# Altium schematic sheet RHD2132_headstage1.SchDoc: RHD2132_headstage1
size 270 x 207 mm; Date: 15/06/2023 10:15:25 PM; SheetNumber: 1; GateName_1: G$1; SymbolName_1: LETTER_L; LibraryName: frames; DeviceSetName: LETTER_L; GateName_2: G$2; SymbolName_2: DOCFIELD
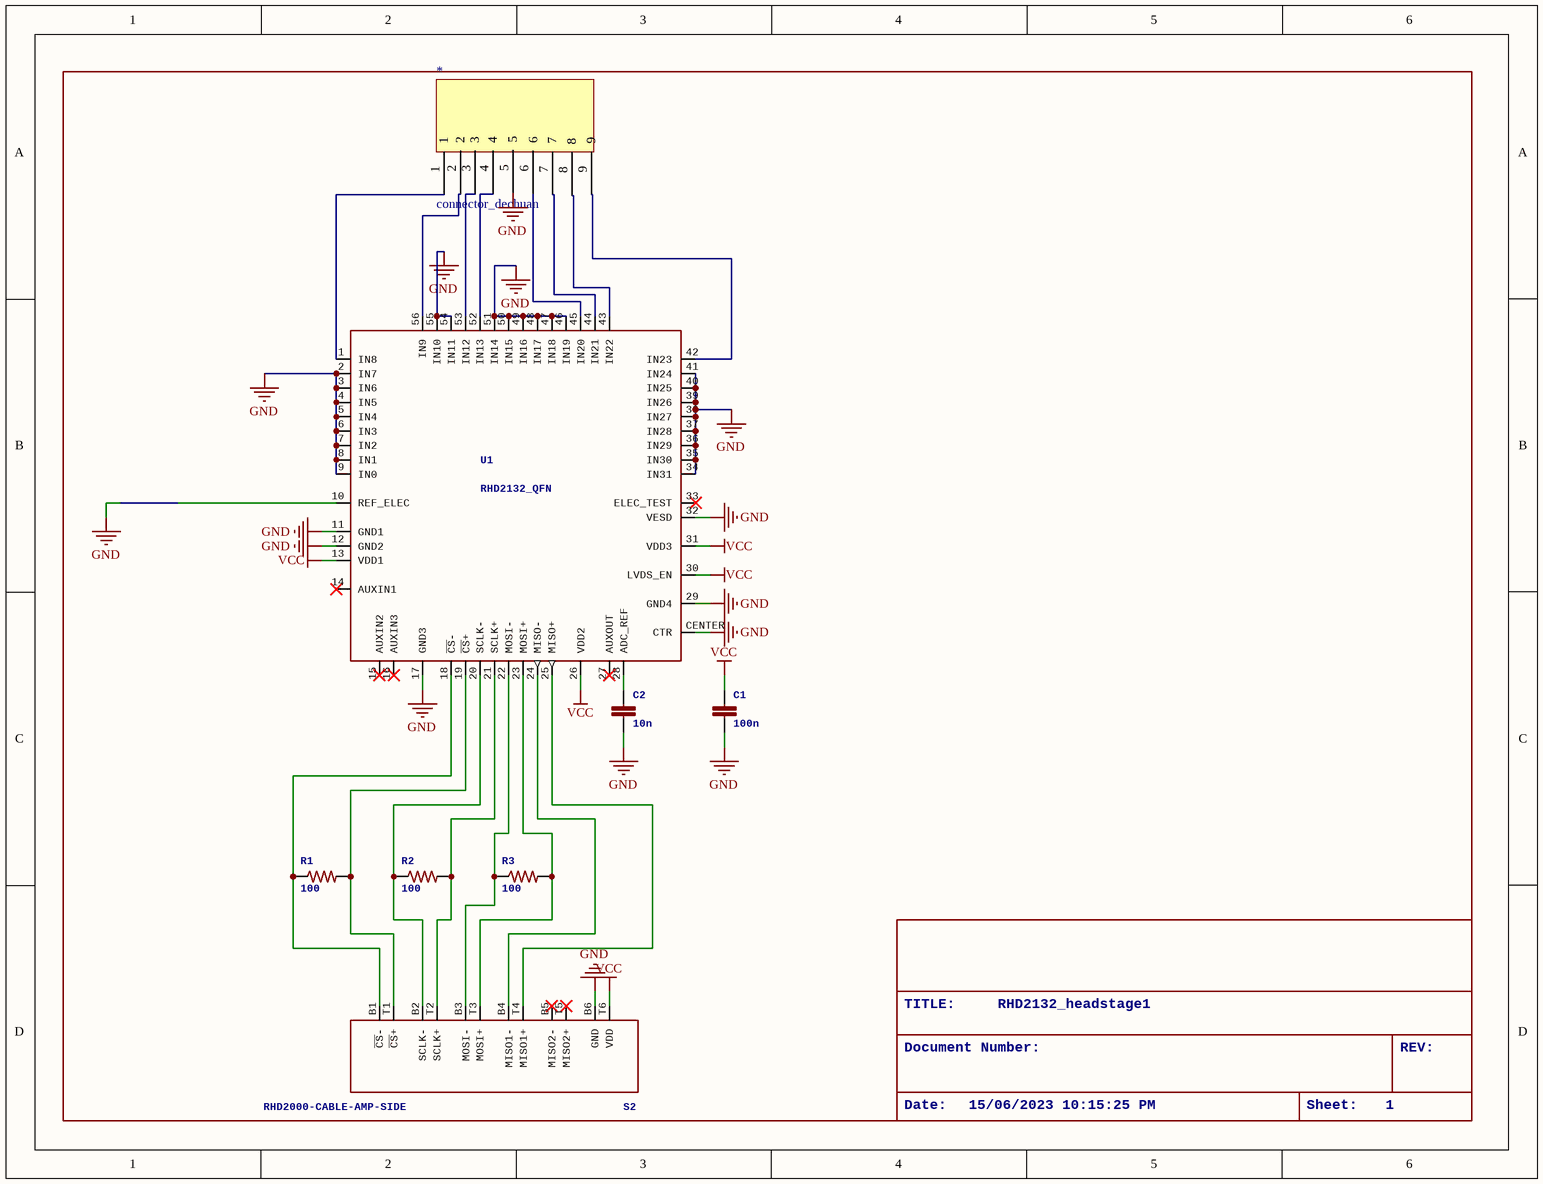
[diagram p0: RHD2132_headstage1.SchDoc]

## Parts
*  connector_dechuan  [connector_dechuan]
C1  100n  [0402]
C2  10n  [0402]
R1  100  [0402]
R2  100  [0402]
R3  100  [0402]
S2  RHD2000-CABLE-AMP-SIDE  [OMNETICS_PZN-12-AA]
U1  RHD2132_QFN  [QFN56_8_X_8_LARGE]

## Nets
GND: *.5 C1.2 C2.2 S2.B6(GND) U1.2(IN7) U1.3(IN6) U1.4(IN5) U1.5(IN4) U1.6(IN3) U1.7(IN2) U1.8(IN1) U1.9(IN0) U1.10(REF_ELEC) U1.11(GND1) U1.12(GND2) U1.17(GND3) U1.29(GND4) U1.32(VESD) U1.34(IN31) U1.35(IN30) U1.36(IN29) U1.37(IN28) U1.38(IN27) U1.39(IN26) U1.40(IN25) U1.41(IN24) U1.46(IN19) U1.47(IN18) U1.48(IN17) U1.49(IN16) U1.50(IN15) U1.51(IN14) U1.54(IN11) U1.55(IN10) U1.CENTER(CTR)
VCC: C1.1 S2.T6(VDD) U1.13(VDD1) U1.26(VDD2) U1.30(LVDS_EN) U1.31(VDD3)
Net*_1: *.1 U1.1(IN8)
Net*_2: *.2 U1.56(IN9)
Net*_3: *.3 U1.53(IN12)
Net*_4: *.4 U1.52(IN13)
Net*_6: *.6 U1.45(IN20)
Net*_7: *.7 U1.44(IN21)
Net*_8: *.8 U1.43(IN22)
Net*_9: *.9 U1.42(IN23)
NetC2_1: C2.1 U1.28(ADC_REF)
NetR1_1: R1.1 S2.B1(~{CS}-) U1.18(~{CS}-)
NetR1_2: R1.2 S2.T1(~{CS}+) U1.19(~{CS}+)
NetR2_1: R2.1 S2.B2(SCLK-) U1.20(SCLK-)
NetR2_2: R2.2 S2.T2(SCLK+) U1.21(SCLK+)
NetR3_1: R3.1 S2.B3(MOSI-) U1.22(MOSI-)
NetR3_2: R3.2 S2.T3(MOSI+) U1.23(MOSI+)
NetS2_B4: S2.B4(MISO1-) U1.24(MISO-)
NetS2_T4: S2.T4(MISO1+) U1.25(MISO+)

Not connected (* = marked no-connect by the designer): S2 B5(MISO2-)* T5(MISO2+)*; U1 14(AUXIN1)* 15(AUXIN2)* 16(AUXIN3)* 27(AUXOUT)* 33(ELEC_TEST)*

## Notes on the sheet
- TITLE:
- Document Number:
- RHD2132_headstage1
- REV:
- Date:
- 15/06/2023 10:15:25 PM
- Sheet:
- 1

## Library data of the parts
C1 C2 = C_0402: Capacitor; GateName_1: C; DeviceName: _0402; SymbolName_1: C; LibraryName: RHD2000_eval_board; DeviceSetName: C
R1-R3 = R_0402: Resistor; GateName_1: R; DeviceName: _0402; SymbolName_1: R; LibraryName: RHD2000_eval_board; DeviceSetName: R
S2 = RHD2000-CABLE-AMP-SIDE: GateName_1: A; SymbolName_1: RHD2000-CABLE; LibraryName: RHD2000; DeviceSetName: RHD2000-CABLE-AMP-SIDE
U1 = RHD2132_QFN: GateName_1: A; DeviceName: _QFN; SymbolName_1: RHD2132; LibraryName: RHD2000; DeviceSetName: RHD2132